# Altium schematic sheet [03] - ESP32.SchDoc: ESP 32
size 433 x 279 mm; Author: ZAG; DrawnBy: ZAG; DocumentNumber: 4; SheetNumber: 3; SheetTotal: 7; PageSetup: Record=PageOptions|CenterHorizontal=True|CenterVertical=True|PrintScale=0.96|XCorrection=1.00|YCorrection=1.00|PrintKind=2|BorderSize=5000000|LeftOffset=0|BottomOffset=0|Orientation=2|PaperLength=4318|PaperWidth=2794|Scale=100|PaperSource=15|PrintQuality=600|MediaType=1|DitherType=10|PaperKind=11x17|PrintScaleMode=1; SchRevision: 01; PCBRevision: 01; Project: YOUTUBE SUBSCRIBER COUNTER; SchStatus: PRELIMINARY; ClientCompanyName: Mule Labs, LLC; ClientContactEmail: zack@mule-labs.com
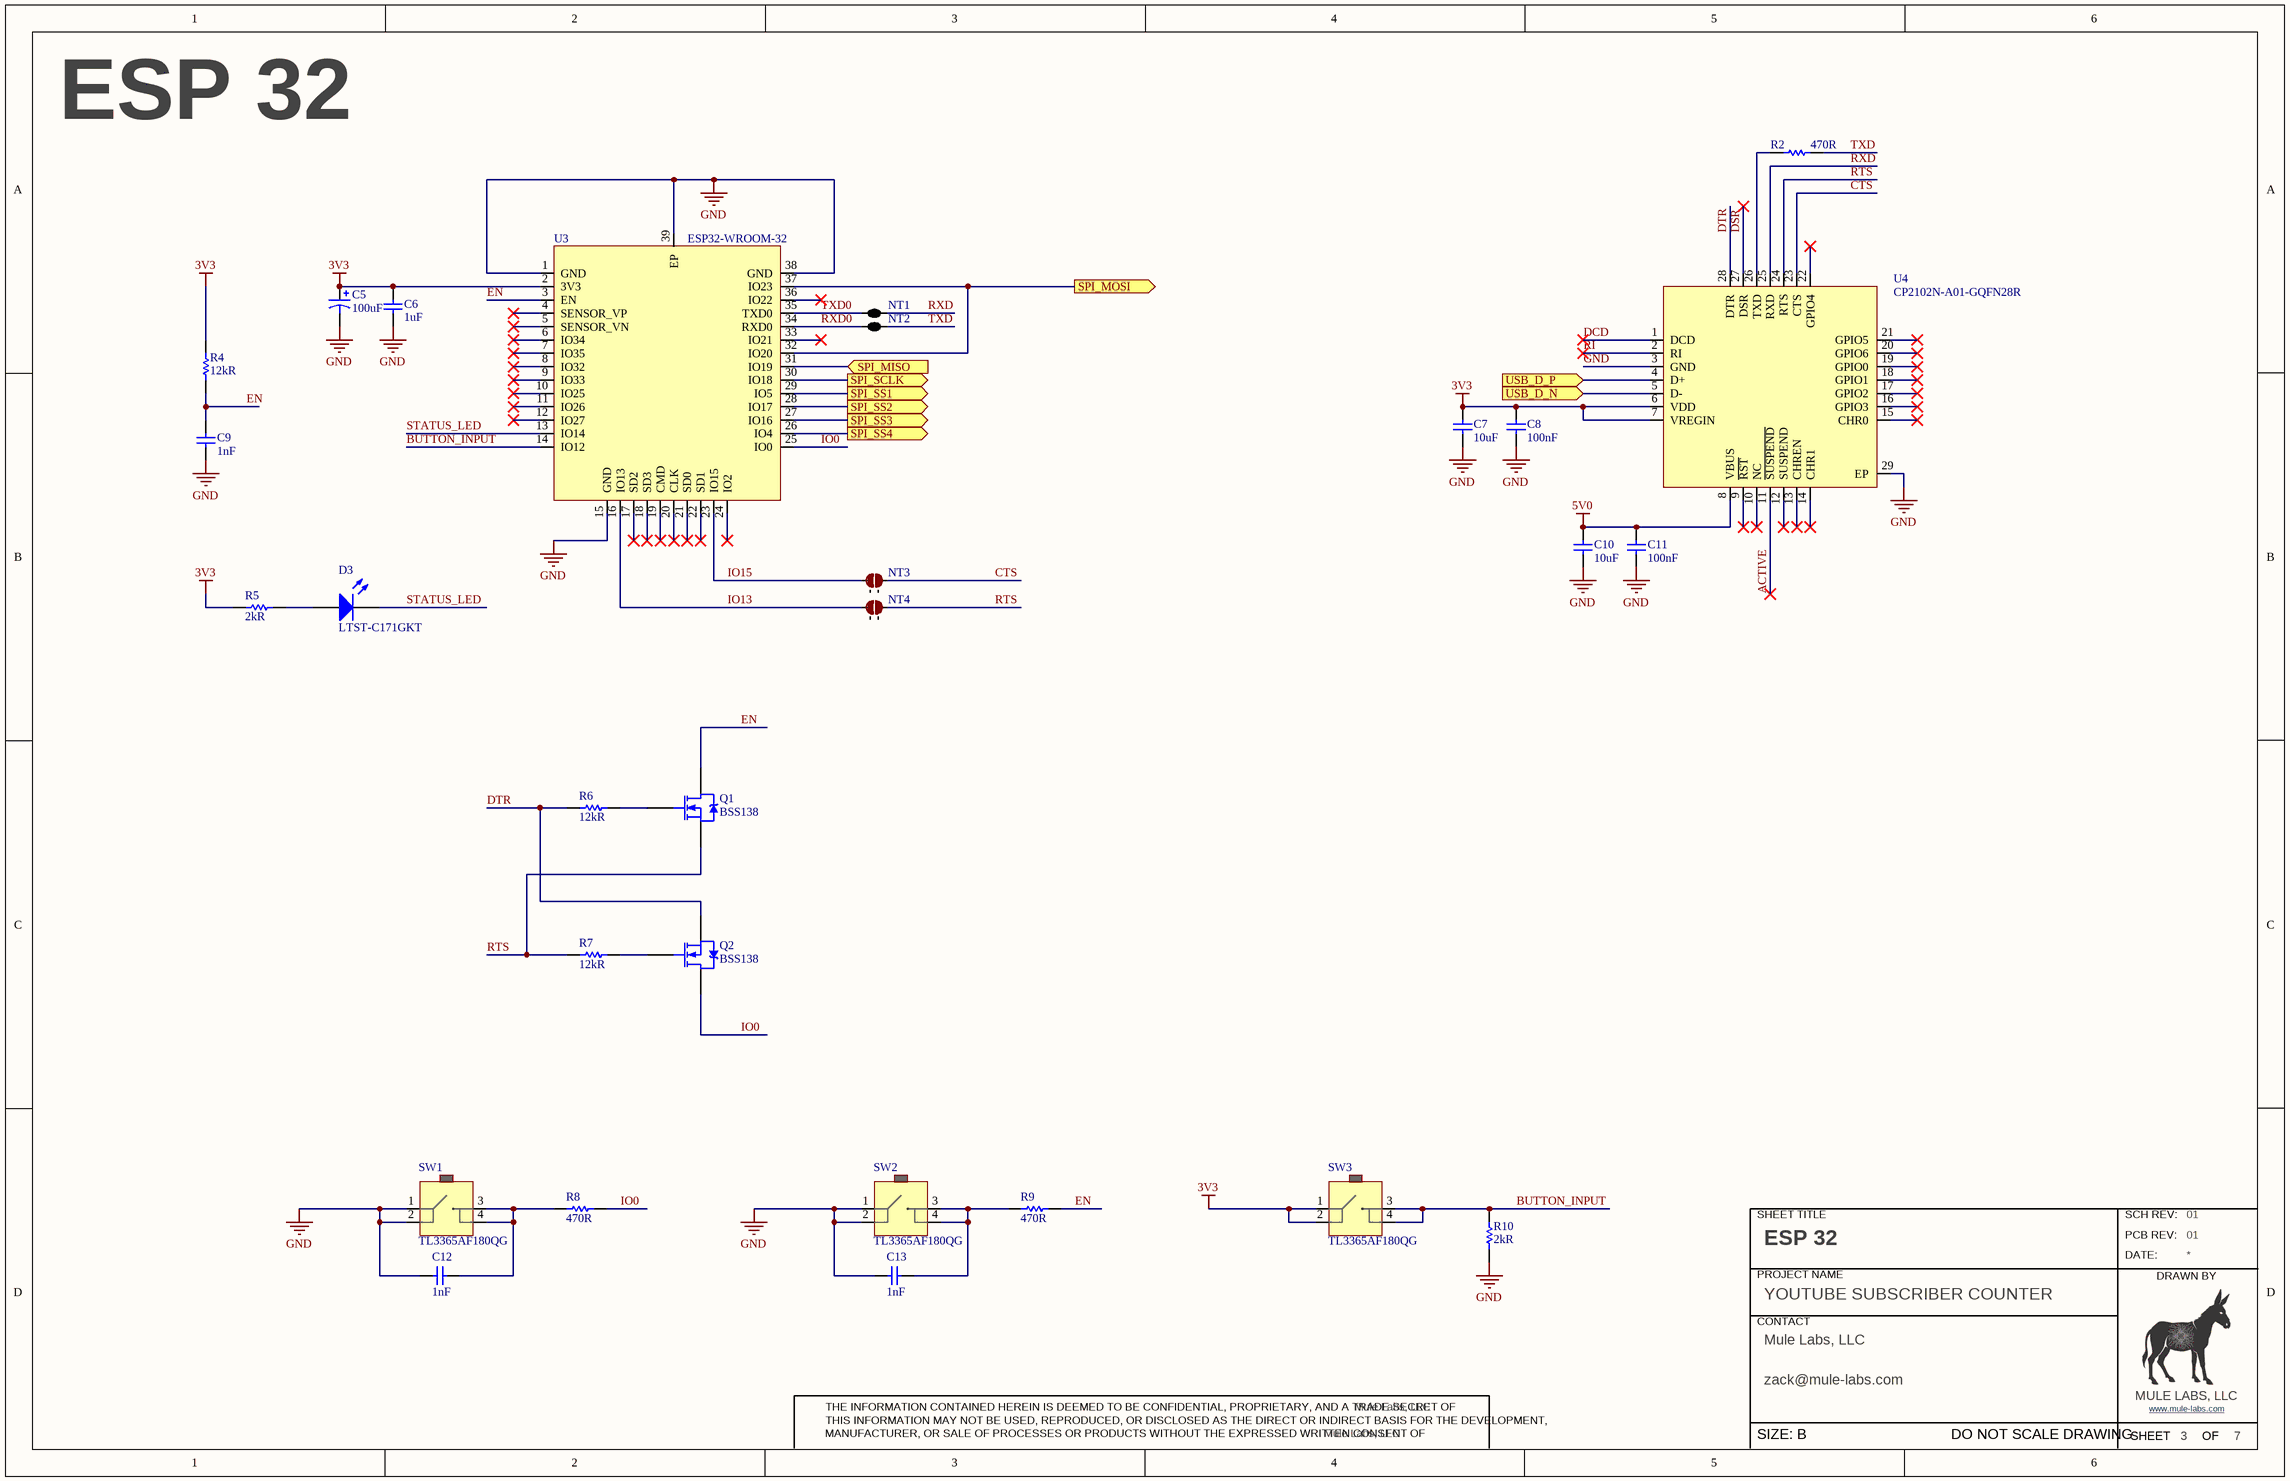
[diagram p0: [03] - ESP32.SchDoc]

## Parts
C5  100uF  [INCH 0603 - METRIC 1608 - H090]
C6  1uF  [INCH 0603 - METRIC 1608 - H090]
C7  10uF  [INCH 0603 - METRIC 1608 - H090]
C8  100nF  [INCH 0603 - METRIC 1608 - H090]
C9  1nF  [INCH 0603 - METRIC 1608 - H090]
C10  10uF  [INCH 0603 - METRIC 1608 - H090]
C11  100nF  [INCH 0603 - METRIC 1608 - H090]
C12  1nF  [INCH 0603 - METRIC 1608 - H090]
C13  1nF  [INCH 0603 - METRIC 1608 - H090]
D3  LTST-C171GKT  [LED - 0805 - GREEN]
NT1  2 way net tie junction  [2way_HP]  (value not drawn)  (net tie, no BOM)
NT2  2 way net tie junction  [2way_HP]  (value not drawn)  (net tie, no BOM)
NT3  2 way net solder junction - Normally Open  [2waySolder_NO]  (value not drawn)  (no BOM)
NT4  2 way net solder junction - Normally Open  [2waySolder_NO]  (value not drawn)  (no BOM)
Q1  BSS138  [SOT95P240X120-3]
Q2  BSS138  [SOT95P240X120-3]
R2  470R  [INCH 0603 - METRIC 1608 - H055]
R4  12kR  [INCH 0603 - METRIC 1608 - H055]
R5  2kR  [INCH 0603 - METRIC 1608 - H055]
R6  12kR  [INCH 0603 - METRIC 1608 - H055]
R7  12kR  [INCH 0603 - METRIC 1608 - H055]
R8  470R  [INCH 0603 - METRIC 1608 - H055]
R9  470R  [INCH 0603 - METRIC 1608 - H055]
R10  2kR  [INCH 0603 - METRIC 1608 - H055]
SW1  TL3365AF180QG  [ESWITCH_TL3365AF180QG]
SW2  TL3365AF180QG  [ESWITCH_TL3365AF180QG]
SW3  TL3365AF180QG  [ESWITCH_TL3365AF180QG]
U3  ESP32-WROOM-32  [ESPRESSIF_ESP32]
U4  CP2102N-A01-GQFN28R  [QFN29P50_500X500X80L55X24T310]

## Ports
SPI_MISO (in), SPI_MOSI (out), SPI_SCLK (out), SPI_SS1 (out), SPI_SS2 (out), SPI_SS3 (out), SPI_SS4 (out), USB_D_N (in), USB_D_P (in)

## Nets
3V3: C5.1 C6.1 C7.1 C8.2 R4.1 R5.1 SW3.1 SW3.2 U3.2(3V3) U4.6(VDD) U4.7(VREGIN)
5V0: C10.1 C11.2 U4.8(VBUS)
GND: C5.2 C6.2 C7.2 C8.1 C9.2 C10.2 C11.1 C12.1 C13.1 R10.2 SW1.1 SW1.2 SW2.1 SW2.2 U3.1(GND) U3.15(GND) U3.38(GND) U3.39(EP) U4.3(GND) U4.29(EP)
ACTIVE: U4.11(~{SUSPEND})
BUTTON_INPUT: R10.1 SW3.3 SW3.4 U3.14(IO12)
CTS: NT3.2 U4.23(CTS)
DCD: U4.1(DCD)
DSR: U4.27(DSR)
DTR: Q2.2(S) R6.1 U4.28(DTR)
EN: C9.1 Q1.3(D) R4.2 R9.2 U3.3(EN)
IO0: Q2.3(D) R8.2 U3.25(IO0)
IO13: NT4.1 U3.16(IO13)
IO15: NT3.1 U3.23(IO15)
RI: U4.2(RI)
RTS: NT4.2 Q1.2(S) R7.1 U4.24(RTS)
RXD: NT1.2 U4.25(RXD)
RXD0: NT2.1 U3.34(RXD0)
SPI_MISO: U3.31(IO19) ; port SPI_MISO
SPI_MOSI: U3.32(IO20) U3.37(IO23) ; port SPI_MOSI
SPI_SCLK: U3.30(IO18) ; port SPI_SCLK
SPI_SS1: U3.29(IO5) ; port SPI_SS1
SPI_SS2: U3.28(IO17) ; port SPI_SS2
SPI_SS3: U3.27(IO16) ; port SPI_SS3
SPI_SS4: U3.26(IO4) ; port SPI_SS4
STATUS_LED: D3.C U3.13(IO14)
TXD: NT2.2 R2.2
TXD0: NT1.1 U3.35(TXD0)
USB_D_N: U4.5(D-) ; port USB_D_N
USB_D_P: U4.4(D+) ; port USB_D_P
NetC12_2: C12.2 R8.1 SW1.3 SW1.4
NetC13_2: C13.2 R9.1 SW2.3 SW2.4
NetD3_A: D3.A R5.2
NetQ1_1: Q1.1(G) R6.2
NetQ2_1: Q2.1(G) R7.2
NetR2_1: R2.1 U4.26(TXD)

Not connected (* = marked no-connect by the designer): U3 4(SENSOR_VP)* 5(SENSOR_VN)* 6(IO34)* 7(IO35)* 8(IO32)* 9(IO33)* 10(IO25)* 11(IO26)* 12(IO27)* 17(SD2)* 18(SD3)* 19(CMD)* 20(CLK)* 21(SD0)* 22(SD1)* 24(IO2)* 33(IO21)* 36(IO22)*; U4 9(~{RST})* 10(NC)* 12(SUSPEND)* 13(CHREN)* 14(CHR1)* 15(CHR0)* 16(GPIO3)* 17(GPIO2)* 18(GPIO1)* 19(GPIO0)* 20(GPIO6)* 21(GPIO5)* 22(GPIO4)*

## Notes on the sheet
- SHEET TITLE
- SCH REV:
- PROJECT NAME
- PCB REV:
- DATE:
- DRAWN BY
- CONTACT
- MANUFACTURER, OR SALE OF PROCESSES OR PRODUCTS WITHOUT THE EXPRESSED WRITTEN CONSENT OF
- THE INFORMATION CONTAINED HEREIN IS DEEMED TO BE CONFIDENTIAL, PROPRIETARY, AND A TRADE SECRET OF
- THIS INFORMATION MAY NOT BE USED, REPRODUCED, OR DISCLOSED AS THE DIRECT OR INDIRECT BASIS FOR THE DEVELOPMENT,
- SHEET
- MULE LABS, LLC
- www.mule-labs.com <http://www.mule-labs.com>
- OF
- SIZE: B
- DO NOT SCALE DRAWING

## Library data of the parts
C5 = F980J107MMAAXE: CAP TANT 100UF 20% 6.3V 0603; Manufacturer: Kyocera AVX; ESR (Equivalent Series Resistance): 10R; Supplier 1: Digi-Key; Manufacturer Part Number: F980J107MMAAXE; RoHS: Yes; Stock 1: 11285; Pricing 1: 1 = 0.67000, 10 = 0.49100, 100 = 0.33670, 500 = 0.26658, 1000 = 0.22448 (USD); Mount: Surface Mount; Case/Package: 0603; Case Code (Metric): 1608; Case Code (Imperial): 0603; Min Operating Temperature: -55°C; Max Operating Temperature: 125°C; Packaging: Tape and Reel; Capacitance: 100uF; Voltage Rating: 6.3V; Tolerance: 20%; Length: 0.063inch; Width: 0.033inch; Height - Seated (Max): 0.035inch; ComponentLink1URL: http://www.farnell.com/datasheets/2602422.pdf?src-supplier=Farnell; ComponentLink1Description: http://www.farnell.com/datasheets/2602422.pdf?src-supplier=Farnell; ComponentLink2URL: http://datasheets.avx.com/F98.pdf?src-supplier=Digi-Key; ComponentLink2Description: http://datasheets.avx.com/F98.pdf?src-supplier=Digi-Key; Supplier Part Number 1: 478-9836-1-ND
C6 = CL10B105KO8NNNC: CAP CER 1UF 16V X7R 0603; Manufacturer: Samsung; Material: Ceramic; Tolerance: 10%; Supplier 1: Digi-Key; Manufacturer Part Number: CL10B105KO8NNNC; Stock 1: 1367836; Pricing 1: 1=0.1, 10=0.046, 100=0.0207, 500=0.01478, 1000=0.01161 (USD); Mount: Surface Mount; Case/Package: 0603; Case Code (Metric): 1608; Case Code (Imperial): 0603; Min Operating Temperature: -55°C; Max Operating Temperature: 125°C; Packaging: Tape and Reel; Capacitance: 1uF; Voltage Rating: 16V; Dielectric: X7R; Voltage: 16V; Voltage Rating (DC): 16V; Length: 1.6mm; Height: 0.8mm; Width: 0.031inch; Thickness: 0.035inch; Depth: 0.8mm; Radiation Hardening: No; Lead Free: Lead Free; ComponentLink1URL: https://datasheet.ciiva.com/15195/getdatasheetpartid-357418-15195728.pdf; ComponentLink1Description: https://datasheet.ciiva.com/15195/getdatasheetpartid-357418-15195728.pdf; ComponentLink2URL: https://datasheet.ciiva.com/29198/458176-da-01-en-vs-kondensator-0603-29198478.pdf; ComponentLink2Description: https://datasheet.ciiva.com/29198/458176-da-01-en-vs-kondensator-0603-29198478.pdf; Supplier Part Number 1: 1276-1019-6-ND; Category: Capacitor
C7 C10 = GRM188R61A106ME69D: CAP CER 10UF 10V X5R 0603; Manufacturer: Murata; Material: Ceramic; Tolerance: 20%; Supplier 1: Digi-Key; Manufacturer Part Number: GRM188R61A106ME69D; Stock 1: 40000; Pricing 1: 1=0.22, 10=0.149, 100=0.0754, 500=0.05158, 1000=0.04563 (USD); Mount: Surface Mount; Case/Package: 0603; Weight: 0.000222oz; Case Code (Metric): 1608; Case Code (Imperial): 0603; Min Operating Temperature: -55°C; Max Operating Temperature: 85°C; Packaging: Tape and Reel; Capacitance: 10uF; Voltage Rating: 10V; Dielectric: X5R; Termination: SMD/SMT; Voltage Rating (DC): 10V; Package Quantity: 4000; Length: 1.6mm; Height: 0.8mm; Width: 0.8mm; Thickness: 0.035inch; Depth: 0.8mm; REACH SVHC: Unknown; Lead Free: Lead Free; ComponentLink1URL: http://components.arrow.com/part/dataview/0323_06119472; ComponentLink1Description: http://components.arrow.com/part/dataview/0323_06119472; ComponentLink2URL: http://www.farnell.com/datasheets/2048014.pdf; ComponentLink2Description: http://www.farnell.com/datasheets/2048014.pdf; ComponentLink3URL: http://search.murata.co.jp/Ceramy/image/img/A01X/G101/ENG/GRM188R61A106ME69-01.pdf; ComponentLink3Description: http://search.murata.co.jp/Ceramy/image/img/A01X/G101/ENG/GRM188R61A106ME69-01.pdf; ComponentLink4URL: http://www.mouser.com/ds/2/281/c02e-2905.pdf; ComponentLink4Description: http://www.mouser.com/ds/2/281/c02e-2905.pdf; ComponentLink5URL: http://www.farnell.com/datasheets/1872210.pdf; ComponentLink5Description: http://www.farnell.com/datasheets/1872210.pdf; Supplier Part Number 1: 490-10475-1-ND; Category: Capacitor
C8 C11 = CGA3E2X7R1E104K080AA: CAP CER 0.1UF 25V X7R 0603; Manufacturer: TDK; Tolerance: 10%; Supplier 1: Digi-Key; Manufacturer Part Number: CGA3E2X7R1E104K080AA; Stock 1: 40000; Pricing 1: 1=0.1, 10=0.068, 100=0.0304, 500=0.02172, 1000=0.01706 (USD); Mount: Surface Mount; Case/Package: 0603; Weight: 7.1E-05oz; Case Code (Metric): 1608; Case Code (Imperial): 0603; Min Operating Temperature: -55°C; Max Operating Temperature: 125°C; Packaging: Tape and Reel; Capacitance: 100nF; Voltage Rating: 25V; Dielectric: X7R; Termination: SMD/SMT; Package Quantity: 1; Voltage Rating (DC): 25V; Composition: Ceramic; Length: 1.6mm; Height: 0.8mm; Depth: 0.8mm; Width: 0.031inch; Thickness: 0.035inch; Lead Free: Lead Free; REACH SVHC: No SVHC; ComponentLink1URL: https://datasheet.ciiva.com/22725/1735392-22725638.pdf; ComponentLink1Description: https://datasheet.ciiva.com/22725/1735392-22725638.pdf; ComponentLink2URL: https://datasheet.ciiva.com/24220/cga3e2x7r1e104k080aa-265934-24220022.pdf; ComponentLink2Description: https://datasheet.ciiva.com/24220/cga3e2x7r1e104k080aa-265934-24220022.pdf; ComponentLink3URL: https://datasheet.ciiva.com/22725/1735392-22725639.pdf; ComponentLink3Description: https://datasheet.ciiva.com/22725/1735392-22725639.pdf; ComponentLink4URL: https://datasheet.ciiva.com/16427/mlccspec-automotive-general-midvoltage-en-16427320.pdf; ComponentLink4Description: https://datasheet.ciiva.com/16427/mlccspec-automotive-general-midvoltage-en-16427320.pdf; ComponentLink5URL: https://datasheet.ciiva.com/23803/1735392-23803082.pdf; ComponentLink5Description: https://datasheet.ciiva.com/23803/1735392-23803082.pdf; Supplier Part Number 1: 445-5667-1-ND; Category: Capacitor
C9 C12 C13 = CL10C102JB8NNNC: CAP CER 1000PF 50V C0G/NP0 0603; Manufacturer: Samsung; Material: Ceramic; Tolerance: 5%; Dielectric: C0G; Temperature Coefficient: 300ppm/°C; Supplier 1: Digi-Key; Manufacturer Part Number: CL10C102JB8NNNC; RoHS: Yes; Stock 1: 2869904; Pricing 1: 1 = 0.10000, 10 = 0.05700, 100 = 0.02530, 500 = 0.01810, 1000 = 0.01422 (USD); Mount: Surface Mount; Case/Package: 0603; Case Code (Metric): 1608; Case Code (Imperial): 0603; Min Operating Temperature: -55°C; Max Operating Temperature: 125°C; Packaging: Tape and Reel; Package Quantity: 1; Voltage Rating: 50V; Capacitance: 1nF; Voltage: 50V; Voltage Rating (DC): 50V; Length: 1.6mm; Height: 0.8mm; Depth: 0.8mm; Width: 0.031inch; Thickness: 0.035inch; Radiation Hardening: No; Lead Free: Lead Free; ComponentLink1URL: https://datasheet.ciiva.com/15195/getdatasheetpartid-354056-15195790.pdf?src-supplier=Verical; ComponentLink1Description: https://datasheet.ciiva.com/15195/getdatasheetpartid-354056-15195790.pdf?src-supplier=Verical; ComponentLink2URL: https://datasheet.ciiva.com/29198/458273-da-01-en-vs-kondensator-0603-29198494.pdf?src-supplier=Conrad; ComponentLink2Description: https://datasheet.ciiva.com/29198/458273-da-01-en-vs-kondensator-0603-29198494.pdf?src-supplier=Conrad; ComponentLink3URL: https://datasheet.ciiva.com/26310/mlcc-catalogdownload2013-eng-26310329.pdf?src-supplier=Distrelec; ComponentLink3Description: https://datasheet.ciiva.com/26310/mlcc-catalogdownload2013-eng-26310329.pdf?src-supplier=Distrelec; Supplier Part Number 1: 1276-1091-1-ND
D3 = LTST-C171GKT: Lite-On LTST-C171GKT, CHIPLED 0805 Series Green LED, 569 nm 2012 (0805), Rectangle Lens SMD package; Manufacturer: Vishay Lite-On; Lens Colour: Clear,Colorless; Viewing Angle: 130°; Lens Style: Clear,Diffused,Colorless,Rectangular; Luminous Intensity: 12mcd; Forward Current: 30mA; Forward Voltage: 2.1V; Power Rating: 100mW; Dominant Wavelength: 569nm; Test Current: 10mA; Lens Transparency: Clear; Number of Elements: 1; Wavelength: 585nm; Reverse Voltage: 5V; Supplier 1: Digi-Key; Manufacturer Part Number: LTST-C171GKT; Stock 1: 271428; Pricing 1: 1=0.29, 10=0.211, 25=0.1556, 100=0.1111, 250=0.07556, 500=0.06666, 1000=0.05222 (USD); Mount: Surface Mount; Case/Package: 0805; Number of Pins: 2; Colour: Green; Case Code (Metric): 2012; Case Code (Imperial): 0805; Min Operating Temperature: -55°C; Max Operating Temperature: 85°C; Package Quantity: 1; Packaging: Tape and Reel; Illumination Colour: Green; Power Dissipation: 100mW; Number of LEDs: 1; Length: 2mm; Height: 0.8mm; Width: 1.25mm; Depth: 1.25mm; Radiation Hardening: No; Lead Free: Lead Free; ComponentLink1URL: https://datasheet.ciiva.com/2110/ltst-c171gkt-2110000.pdf; ComponentLink1Description: https://datasheet.ciiva.com/2110/ltst-c171gkt-2110000.pdf; ComponentLink2URL: https://datasheet.ciiva.com/2110/ltst-c171gkt-2110001.pdf; ComponentLink2Description: https://datasheet.ciiva.com/2110/ltst-c171gkt-2110001.pdf; ComponentLink3URL: https://datasheet.ciiva.com/2110/ltst-c171gkt-2110002.pdf; ComponentLink3Description: https://datasheet.ciiva.com/2110/ltst-c171gkt-2110002.pdf; ComponentLink4URL: https://datasheet.ciiva.com/16396/ltst-c171gkt-16396549.pdf; ComponentLink4Description: https://datasheet.ciiva.com/16396/ltst-c171gkt-16396549.pdf; ComponentLink5URL: https://datasheet.ciiva.com/11773/0900766b80dc0296-11773991.pdf; ComponentLink5Description: https://datasheet.ciiva.com/11773/0900766b80dc0296-11773991.pdf; ComponentLink6URL: https://datasheet.ciiva.com/12400/lite-on-ltst-c171gkt-190133-12400647.pdf; ComponentLink6Description: https://datasheet.ciiva.com/12400/lite-on-ltst-c171gkt-190133-12400647.pdf; Supplier Part Number 1: 160-1423-1-ND; Category: LED
NT1 NT2 = 2way: ComponentLink1URL: http://www.edatools.cz/addons; ComponentLink1Description: Source; FootprintNote: LP=12mil, MP=40mil, HP=120mil
NT3 NT4 = 2waySolderNO: ComponentLink1URL: http://www.edatools.cz/addons; ComponentLink1Description: Source
Q1 Q2 = BSS138: MOSFET N-CH 50V 220MA SOT-23; Manufacturer: ON Semiconductor / Fairchild; Rds On Max: 3.5R; Input Capacitance: 27pF; Max Power Dissipation: 360mW; Turn-Off Delay Time: 20ns; Turn-On Delay Time: 2.5ns; Gate to Source Voltage (Vgs): 20V; Number of Elements: 1; Threshold Voltage: 1.3V; Element Configuration: Single; On-State Resistance: 6R; Rise Time: 9ns; Supplier 1: Digi-Key; Manufacturer Part Number: BSS138; Stock 1: 1717197; Pricing 1: 1=0.32, 10=0.292, 100=0.1633, 500=0.0875, 1000=0.0595 (USD); Mount: Surface Mount; Case/Package: SOT-23; Number of Pins: 3; Weight: 0.03g; Contact Plating: Tin,Matte; Min Operating Temperature: -55°C; Max Operating Temperature: 150°C; Packaging: Tape and Reel; Continuous Drain Current (ID): 220mA; Power Dissipation: 360mW; Package Quantity: 1; Drain to Source Voltage (Vdss): 50V; Drain to Source Breakdown Voltage: 50V; Drain to Source Resistance: 3.5R; Nominal Vgs: 1.3V; Voltage Rating (DC): 50V; Current Rating: 220mA; Fall Time: 9ns; Dual Supply Voltage: 50V; Termination: SMD/SMT; Length: 2.92mm; Height: 0.93mm; Width: 1.3mm; Radiation Hardening: No; REACH SVHC: No SVHC; Lead Free: Lead Free; ComponentLink1URL: https://datasheet.ciiva.com/931/bss138-931776.pdf; ComponentLink1Description: https://datasheet.ciiva.com/931/bss138-931776.pdf; ComponentLink2URL: https://datasheet.ciiva.com/1190/193736-1190130.pdf; ComponentLink2Description: https://datasheet.ciiva.com/1190/193736-1190130.pdf; ComponentLink3URL: https://datasheet.ciiva.com/1190/193736-1190131.pdf; ComponentLink3Description: https://datasheet.ciiva.com/1190/193736-1190131.pdf; ComponentLink4URL: https://datasheet.ciiva.com/1254/193736-1254983.pdf; ComponentLink4Description: https://datasheet.ciiva.com/1254/193736-1254983.pdf; ComponentLink5URL: https://datasheet.ciiva.com/3304/bss138-3304423.pdf; ComponentLink5Description: https://datasheet.ciiva.com/3304/bss138-3304423.pdf; ComponentLink6URL: https://datasheet.ciiva.com/3304/bss138-3304424.pdf; ComponentLink6Description: https://datasheet.ciiva.com/3304/bss138-3304424.pdf; ComponentLink7URL: https://datasheet.ciiva.com/22655/193736-22655240.pdf; ComponentLink7Description: https://datasheet.ciiva.com/22655/193736-22655240.pdf; ComponentLink8URL: https://datasheet.ciiva.com/16834/bss138-16834843.pdf; ComponentLink8Description: https://datasheet.ciiva.com/16834/bss138-16834843.pdf; ComponentLink9URL: https://datasheet.ciiva.com/27050/784896-27050043.pdf; ComponentLink9Description: https://datasheet.ciiva.com/27050/784896-27050043.pdf; ComponentLink10URL: https://datasheet.ciiva.com/26229/bss138-26229007.pdf; ComponentLink10Description: https://datasheet.ciiva.com/26229/bss138-26229007.pdf; Supplier Part Number 1: BSS138CT-ND; Category: Transistor
R2 R8 R9 = RC0603FR-07470RL: RES SMD 470 OHM 1% 1/10W 0603; Manufacturer: Yageo; Power Rating: 100mW; Temperature Coefficient: 100ppm/°C; Voltage Rating: 50V; Working Voltage: 75V; Supplier 1: Digi-Key; Manufacturer Part Number: RC0603FR-07470RL; RoHS: Yes; Stock 1: 7725827; Pricing 1: 1 = 0.10000, 10 = 0.02400, 100 = 0.00970, 1000 = 0.00437, 2500 = 0.00379 (USD); Case/Package: 0603; Case Code (Metric): 1608; Case Code (Imperial): 0603; Min Operating Temperature: -55°C; Max Operating Temperature: 155°C; Tolerance: 1%; Resistance: 470R; Packaging: Tape and Reel; Package Quantity: 1; Composition: Thick Film; Number of Terminations: 2; Termination: SMD/SMT; Military Standard: Not; Max Power Dissipation: 100mW; Features: Moisture Resistant; Length: 1.6mm; Height: 0.022inch; Width: 0.031inch; Depth: 0.8mm; REACH SVHC: No SVHC; Lead Free: Lead Free; ComponentLink1URL: https://datasheet.ciiva.com/11808/0900766b80f96399-11808177.pdf?src-supplier=RSComponents; ComponentLink1Description: https://datasheet.ciiva.com/11808/0900766b80f96399-11808177.pdf?src-supplier=RSComponents; ComponentLink2URL: https://datasheet.ciiva.com/7746/1738695-7746359.pdf?src-supplier=Element14; ComponentLink2Description: https://datasheet.ciiva.com/7746/1738695-7746359.pdf?src-supplier=Element14; ComponentLink3URL: https://datasheet.ciiva.com/7746/1738695-7746360.pdf?src-supplier=Element14; ComponentLink3Description: https://datasheet.ciiva.com/7746/1738695-7746360.pdf?src-supplier=Element14; ComponentLink4URL: https://datasheet.ciiva.com/7660/1868787-7660793.pdf?src-supplier=Element14; ComponentLink4Description: https://datasheet.ciiva.com/7660/1868787-7660793.pdf?src-supplier=Element14; ComponentLink5URL: https://datasheet.ciiva.com/46440/1868787-46440907.pdf?src-supplier=Element14; ComponentLink5Description: https://datasheet.ciiva.com/46440/1868787-46440907.pdf?src-supplier=Element14; ComponentLink6URL: https://datasheet.ciiva.com/2454/pyu-r-int-thick-7-2454012.pdf?src-supplier=Digi-Key; ComponentLink6Description: https://datasheet.ciiva.com/2454/pyu-r-int-thick-7-2454012.pdf?src-supplier=Digi-Key; ComponentLink7URL: https://datasheet.ciiva.com/2454/pyu-r-int-thick-7-2454013.pdf?src-supplier=Digi-Key; ComponentLink7Description: https://datasheet.ciiva.com/2454/pyu-r-int-thick-7-2454013.pdf?src-supplier=Digi-Key; ComponentLink8URL: https://datasheet.ciiva.com/2454/pyu-r-int-thick-7-2454014.pdf?src-supplier=Digi-Key; ComponentLink8Description: https://datasheet.ciiva.com/2454/pyu-r-int-thick-7-2454014.pdf?src-supplier=Digi-Key; Supplier Part Number 1: 311-470HRCT-ND
R4 R6 R7 = RC0603FR-0712KL: RES SMD 12K OHM 1% 1/10W 0603; Manufacturer: Yageo; Power Rating: 100mW; Voltage Rating (DC): 50V; Temperature Coefficient: 100ppm/°C; Supplier 1: Digi-Key; Manufacturer Part Number: RC0603FR-0712KL; RoHS: Yes; Stock 1: 3108681; Pricing 1: 1 = 0.100000, 10 = 0.024000, 100 = 0.009700, 1000 = 0.004370, 2500 = 0.003790 (USD); Case/Package: 0603; Number of Pins: 2; Case Code (Imperial): 0603; Case Code (Metric): 1608; Min Operating Temperature: -55°C; Max Operating Temperature: 155°C; Resistance: 12kR; Tolerance: 1%; Packaging: Tape and Reel; Voltage Rating: 50V; Termination: SMD/SMT; Composition: Thick Film; Package Quantity: 1; Number of Terminations: 2; Military Standard: Not; Max Power Dissipation: 100mW; Features: Moisture Resistant; Length: 0.063inch; Height: 0.022inch; Width: 0.031inch; Depth: 0.8mm; REACH SVHC: No SVHC; Lead Free: Lead Free; ComponentLink1URL: https://datasheet.ciiva.com/11819/0900766b80f96399-11819238.pdf?src-supplier=RSComponents; ComponentLink1Description: https://datasheet.ciiva.com/11819/0900766b80f96399-11819238.pdf?src-supplier=RSComponents; ComponentLink2URL: https://datasheet.ciiva.com/2454/pyu-r-int-thick-7-2454282.pdf?src-supplier=Digi-Key; ComponentLink2Description: https://datasheet.ciiva.com/2454/pyu-r-int-thick-7-2454282.pdf?src-supplier=Digi-Key; ComponentLink3URL: https://datasheet.ciiva.com/7746/1784430-7746250.pdf?src-supplier=Element14; ComponentLink3Description: https://datasheet.ciiva.com/7746/1784430-7746250.pdf?src-supplier=Element14; ComponentLink4URL: https://datasheet.ciiva.com/46412/443971-46412842.pdf?src-supplier=Element14; ComponentLink4Description: https://datasheet.ciiva.com/46412/443971-46412842.pdf?src-supplier=Element14; ComponentLink5URL: https://datasheet.ciiva.com/2454/pyu-r-int-thick-7-2454283.pdf?src-supplier=Digi-Key; ComponentLink5Description: https://datasheet.ciiva.com/2454/pyu-r-int-thick-7-2454283.pdf?src-supplier=Digi-Key; ComponentLink6URL: https://datasheet.ciiva.com/7746/1784430-7746251.pdf?src-supplier=Element14; ComponentLink6Description: https://datasheet.ciiva.com/7746/1784430-7746251.pdf?src-supplier=Element14; ComponentLink7URL: https://datasheet.ciiva.com/2454/pyu-r-int-thick-7-2454284.pdf?src-supplier=Digi-Key; ComponentLink7Description: https://datasheet.ciiva.com/2454/pyu-r-int-thick-7-2454284.pdf?src-supplier=Digi-Key; Supplier Part Number 1: 311-12.0KHRCT-ND
R5 R10 = RC0603FR-072KL: RES SMD 2K OHM 1% 1/10W 0603; Manufacturer: Yageo; Temperature Coefficient: 100ppm/°C; Voltage Rating (DC): 50V; Power Rating: 100mW; Working Voltage: 75V; Supplier 1: Digi-Key; Manufacturer Part Number: RC0603FR-072KL; RoHS: Yes; Stock 1: 10567101; Pricing 1: 1 = 0.10000, 10 = 0.02400, 100 = 0.00970, 1000 = 0.00437, 2500 = 0.00379 (USD); Case/Package: 0603; Number of Pins: 2; Case Code (Metric): 1608; Case Code (Imperial): 0603; Min Operating Temperature: -55°C; Max Operating Temperature: 155°C; Resistance: 2kR; Tolerance: 1%; Packaging: Tape and Reel; Composition: Thick Film; Voltage Rating: 50V; Package Quantity: 1; Number of Terminations: 2; Termination: SMD/SMT; Military Standard: Not; Max Power Dissipation: 100mW; Features: Moisture Resistant; Length: 1.6mm; Height: 0.45mm; Width: 0.031inch; Depth: 0.8mm; Lead Free: Lead Free; REACH SVHC: No SVHC; ComponentLink1URL: https://datasheet.ciiva.com/11808/0900766b80f96399-11808134.pdf?src-supplier=RSComponents; ComponentLink1Description: https://datasheet.ciiva.com/11808/0900766b80f96399-11808134.pdf?src-supplier=RSComponents; ComponentLink2URL: https://datasheet.ciiva.com/22747/443971-22747526.pdf?src-supplier=Element14; ComponentLink2Description: https://datasheet.ciiva.com/22747/443971-22747526.pdf?src-supplier=Element14; ComponentLink3URL: https://datasheet.ciiva.com/2453/pyu-r-int-thick-7-2453913.pdf?src-supplier=Digi-Key; ComponentLink3Description: https://datasheet.ciiva.com/2453/pyu-r-int-thick-7-2453913.pdf?src-supplier=Digi-Key; ComponentLink4URL: https://datasheet.ciiva.com/12555/rc0603-272842-12555257.pdf?src-supplier=Mouser; ComponentLink4Description: https://datasheet.ciiva.com/12555/rc0603-272842-12555257.pdf?src-supplier=Mouser; ComponentLink5URL: https://datasheet.ciiva.com/2453/pyu-r-int-thick-7-2453914.pdf?src-supplier=Digi-Key; ComponentLink5Description: https://datasheet.ciiva.com/2453/pyu-r-int-thick-7-2453914.pdf?src-supplier=Digi-Key; ComponentLink6URL: https://datasheet.ciiva.com/2453/pyu-r-int-thick-7-2453915.pdf?src-supplier=Digi-Key; ComponentLink6Description: https://datasheet.ciiva.com/2453/pyu-r-int-thick-7-2453915.pdf?src-supplier=Digi-Key; Supplier Part Number 1: 311-2.00KHRCT-ND
SW1-SW3 = TL3365AF180QG: SWITCH TACTILE SPST-NO 0.05A 12V; Manufacturer: E-Switch; Mechanical Life: 100000Cycles; Illumination Type: Non-Illuminated; Operating Force: 180gf; Throw Configuration: SPST; Switch Travel: 0.2mm; Switch Function: Off-Mom; Supplier 1: Digi-Key; Manufacturer Part Number: TL3365AF180QG; Stock 1: 55347; Pricing 1: 1=0.34, 10=0.333, 25=0.3208, 50=0.3088, 100=0.297, 250=0.27324, 500=0.2376, 1000=0.20196 (USD); Mount: Surface Mount; Min Operating Temperature: -20°C; Max Operating Temperature: 70°C; Packaging: Tape and Reel; Termination: Gull Wing; Lead Free: Lead Free; Supplier Part Number 1: EG5384CT-ND
U3 = ESP32-WROOM-32: SMD MODULE, ESP32-D0WDQ6, 32MBIT; Manufacturer: Espressif Systems; Supplier 1: Digi-Key; Manufacturer Part Number: ESP32-WROOM-32; Stock 1: 1206; Pricing 1: 1 = 3.80000 (USD); Supplier Part Number 1: 1904-1010-1-ND
U4 = CP2102N-A01-GQFN28R: IC BRIDGE USB TO UART 28QFN; Manufacturer: Silicon Labs; Supplier 1: Digi-Key; Manufacturer Part Number: CP2102N-A01-GQFN28R; RoHS: No; Stock 1: 5381; Pricing 1: 1 = 1.40000, 25 = 1.35160, 100 = 1.29950 (USD); ComponentLink1URL: https://www.silabs.com/documents/public/data-sheets/cp2102n-datasheet.pdf?src-supplier=Digi-Key; ComponentLink1Description: https://www.silabs.com/documents/public/data-sheets/cp2102n-datasheet.pdf?src-supplier=Digi-Key; Supplier Part Number 1: 336-4738-1-ND